# Altium schematic sheet GateDriver.SchDoc
size A3; SheetNumber: 3; SheetTotal: 4
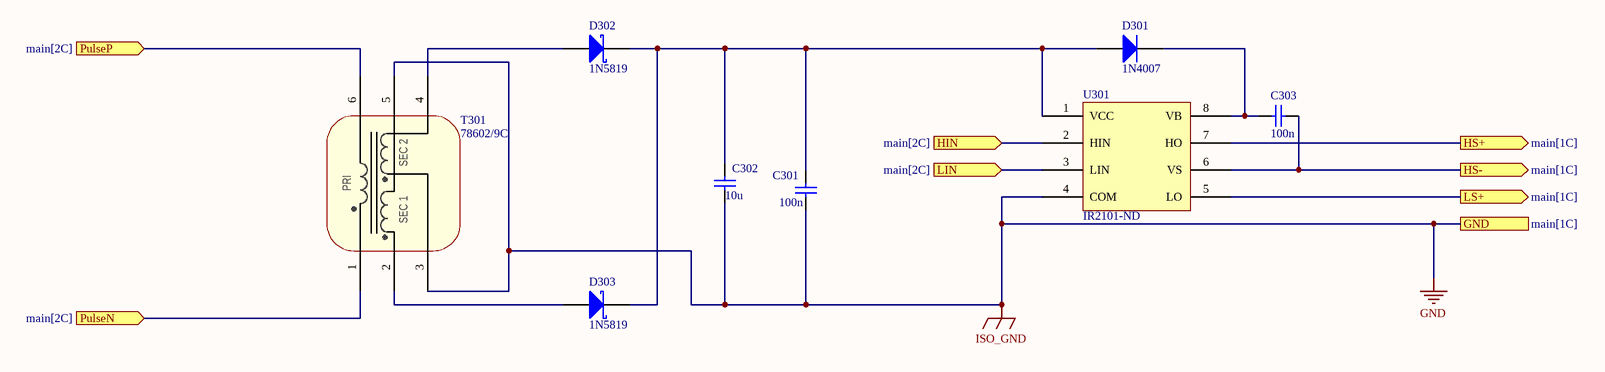
[diagram p0: GateDriver.SchDoc]

## Parts
C301  100n  [CAP_1206]
C302  10u  [CAP_1206]
C303  100n  [RAD-0.2_AUT]
D301  1N4007  [DIODE0.4_AUT]
D302  1N5819  [DIODE0.4_AUT]
D303  1N5819  [DIODE0.4_AUT]
T301  78602/9C  [DIP6W_AUT]
U301  IR2101-ND  [DIP8-AUT]

## Ports
GND (see main[1C]), HIN (in, see main[2C]), HS+ (out, see main[1C]), HS- (out, see main[1C]), LIN (in, see main[2C]), LS+ (out, see main[1C]), PulseN (in, see main[2C]), PulseP (in, see main[2C])

## Nets
GND: C301.1 C302.1 T301.3(Sec1_2) T301.5(Sec1_2) U301.4(COM) ; port GND  [also labelled ISO_GND]
HIN: U301.2(HIN) ; port HIN
HS+: U301.7(HO) ; port HS+
HS-: C303.2 U301.6(VS) ; port HS-
LIN: U301.3(LIN) ; port LIN
LS+: U301.5(LO) ; port LS+
PulseN: T301.1(Pri_1) ; port PulseN
PulseP: T301.6(Pri2) ; port PulseP
NetC301_2: C301.2 C302.2 D301.A D302.K D303.K U301.1(VCC)
NetC303_1: C303.1 D301.K U301.8(VB)
NetD302_A: D302.A T301.4(Sec2_2)
NetD303_A: D303.A T301.2(Sec1_1)

## Notes on the sheet
- (in symbol 78602/9C) SEC 2; PRI; SEC 1

## Library data of the parts
C301 C302 = CAPN 1206: Non Polarized Capacitor, SMD, 1206
C303 = CAPN RAD0.2: Non Polarized Capacitor, Multilayer Ceramic Dipped Radial, Pitch 200mil
D301 = 1N4007: Diode, Standard, 1A, 1000v; Supplier 1: Farnell; Supplier Part Number 1: 9549129
D302 D303 = 1N5819: Schottky Diode, 1A,40v; Supplier 1: Farnell; Supplier Part Number 1: 1017589
T301 = 78602/9C: Pulse transformer 1:1:1
U301 = IR2101-ND: Half-Bridge Gate Driver IC Non-Inverting 8-PDIP